# Altium project P_22_CtlBrd.PrjPcb
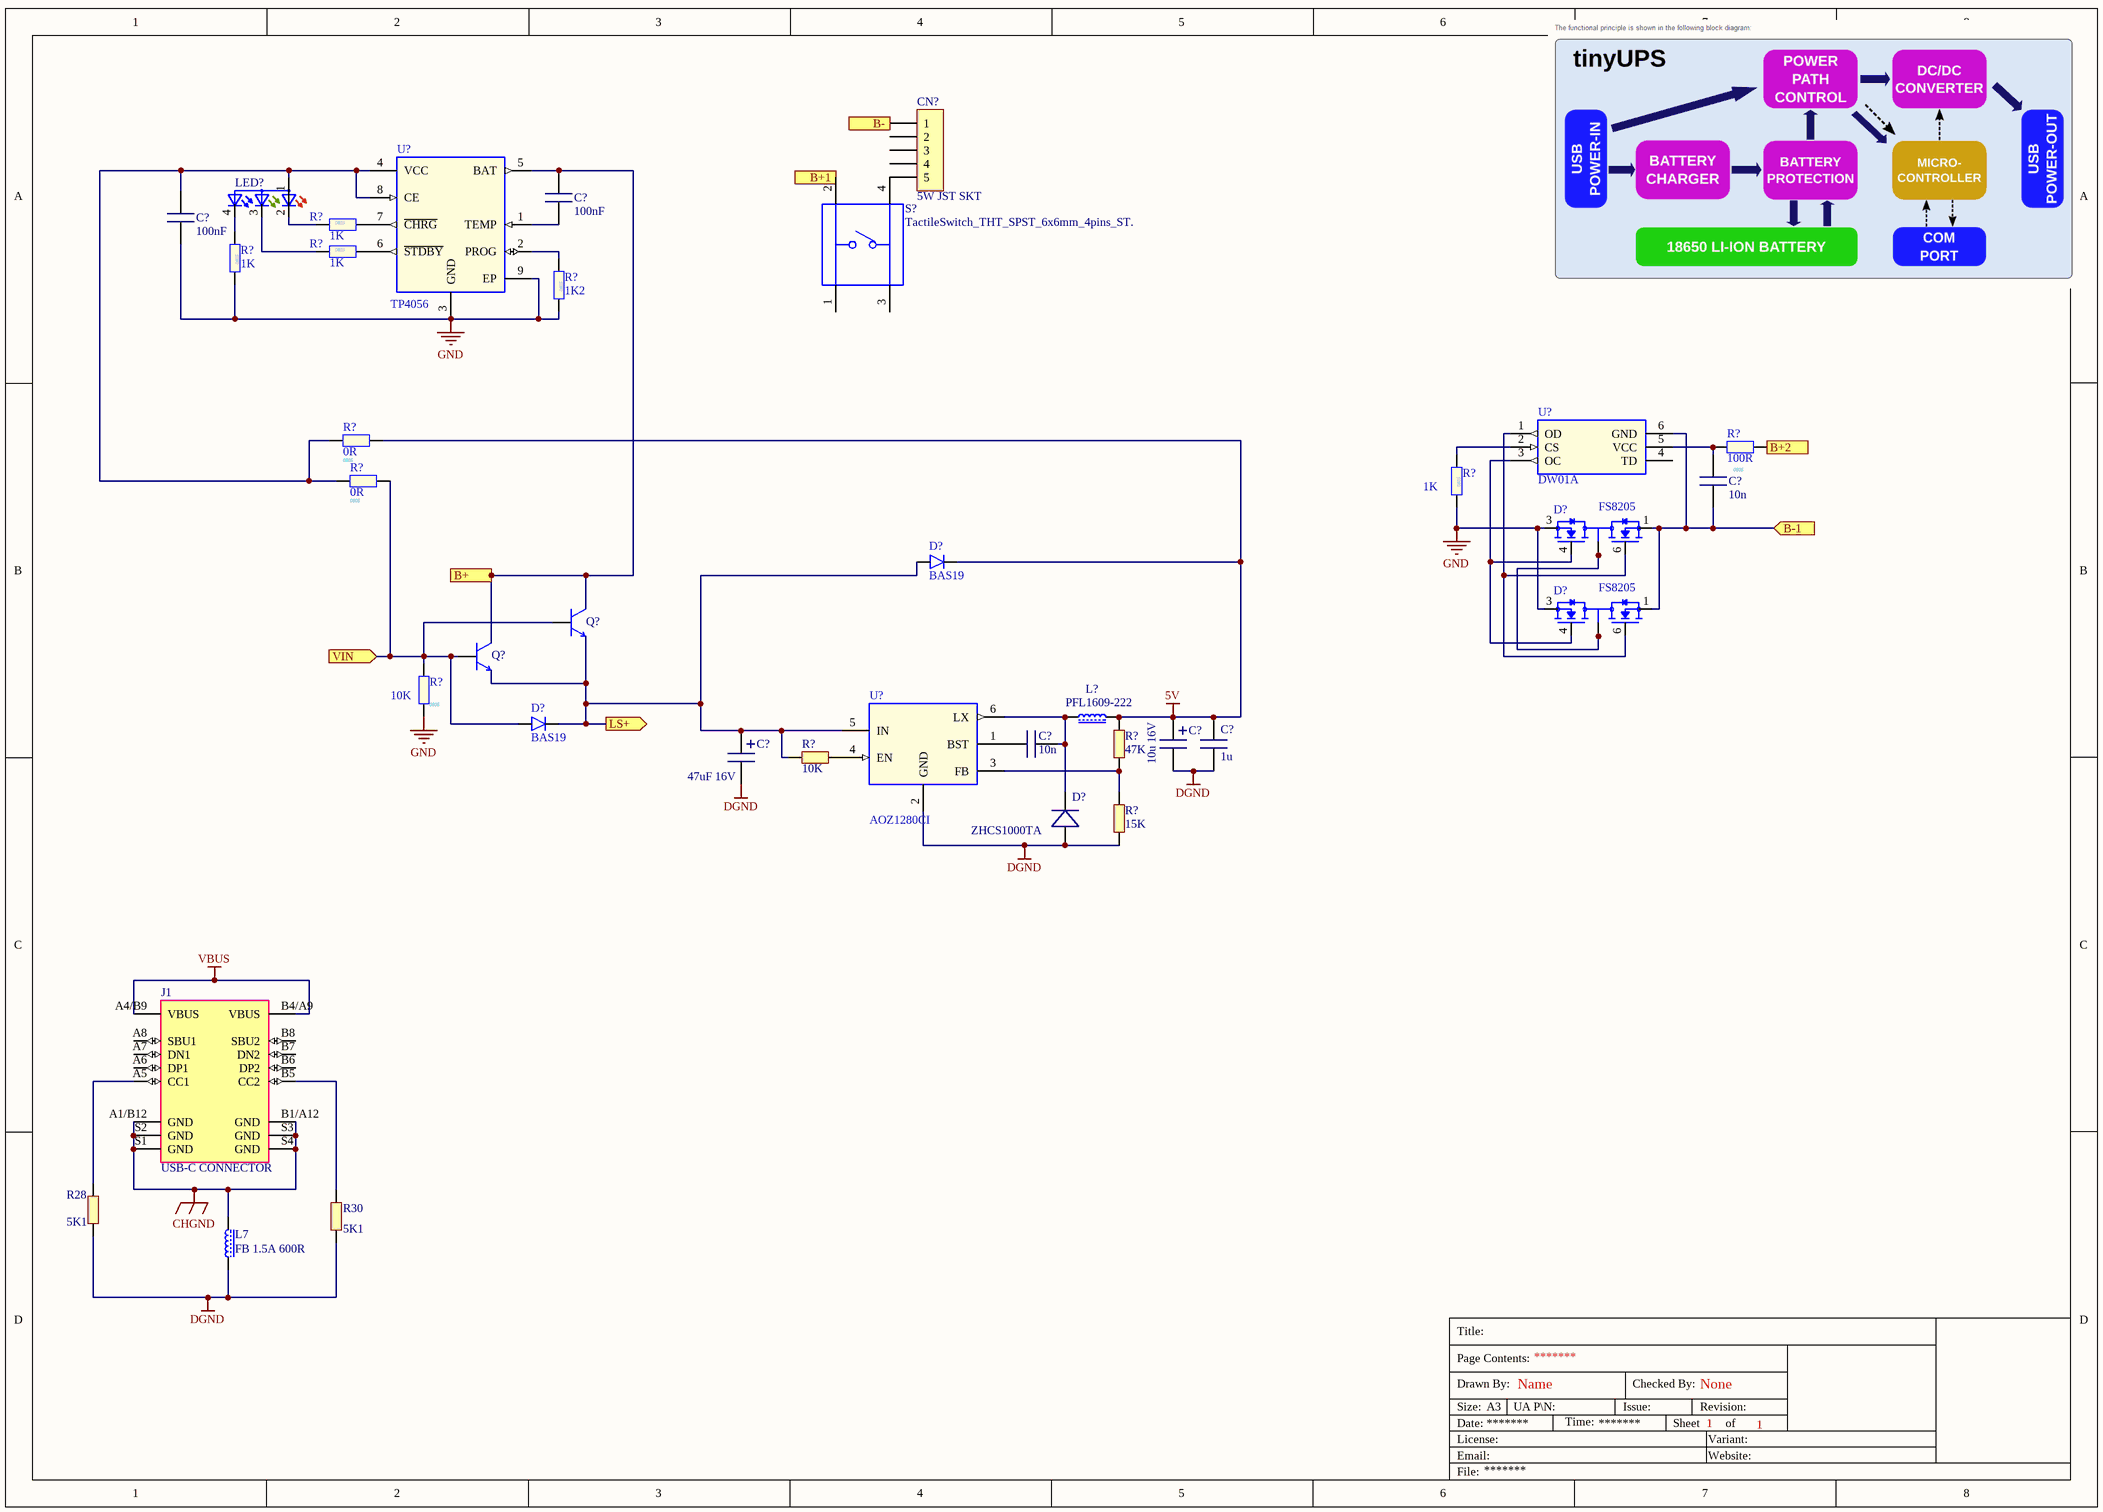
[diagram p0: CtlBoard - Copy.SchDoc]
2 sheets, 74 parts. Net scope: flat (ports and power ports of the same name join across sheets).
Sheets:
  CtlBoard - Copy.SchDoc
  CtlBoard.SchDoc

## Sheet CtlBoard - Copy.SchDoc: Title
size A3; Date: *******; ApprovedBy: *******; CheckedBy: None; Author: *******; CompanyName: *******; DrawnBy: Name; Engineer: *******; Organization: *******; Address1: *******; Address2: *******; Address3: *******; Address4: *******; DocumentNumber: Doc Num; Revision: *******; SheetNumber: 1; SheetTotal: 1; CurrentTime: *******; CurrentDate: *******; Time: *******; DocumentFullPathAndName: *******; DocumentName: *******; ModifiedDate: *******; ImagePath: *******; ProjectName: *******; Application_BuildNumber: *******

### Parts
(Parts that share a designator on the sheet are numbered #1, #2 ... from top to bottom, then left to right.)
C?#1  100nF  [CAP 0402]
C?#2  100nF  [CAP 0402]
C?#3  10n  [CAP 0805]
C?#4  10n  [CAP 0805]
C?#5  10u 16V  [CAP CASE B]
C?#6  1u  [CAP 0805]
C?#7  47uF 16V  [CAP CASE D]
CN?  5W JST SKT  [[0507]THT_Hdr_JST_XH_Fm_5x1_0.08_ST]
D?#1  FS8205  [SOT95P280X145-6N]
D?#2  BAS19  [SOT95P230X110-3N]
D?#3  FS8205  [SOT95P280X145-6N]
D?#4  BAS19  [SOT95P230X110-3N]
D?#5  ZHCS1000TA  [SOT-23]
J1#1  USB-C CONNECTOR  [GCT_USB4110-GF-A_REVB]
L7  FB 1.5A 600R  [RES 1206]
L?  PFL1609-222  [PL1609]
LED?  ASMB-KTF0-0A306  [LED_ASMB-KTF0-0A306]  (value not drawn)
Q?#1  BC846A  [[0301]BC846B_SOT23]  (value not drawn)
Q?#2  BC846A  [[0301]BC846B_SOT23]  (value not drawn)
R28  5K1  [RES 0805]
R30  5K1  [RES 0805]
R?#1  1K  Footprint: 0805  [RES 0805]
R?#2  1K  Footprint: 0805  [RES 0805]
R?#3  1K  Footprint: 0805  [RES 0805]
R?#4  1K2  Footprint: 0805  [RES 0805]
R?#5  0R  Footprint: 0805  [RES 0805]
R?#6  100R  Footprint: 0805  [RES 0805]
R?#7  0R  Footprint: 0805  [RES 0805]
R?#8  1K  Footprint: 0805  [RES 0805]
R?#9  10K  Footprint: 0805  [RES 0805]
R?#10  47K  [RES 0805]
R?#11  10K  [RES 0805]
R?#12  15K  [RES 0805]
S?  TactileSwitch_THT_SPST_6x6mm_4pins_ST.  [TactileSwitch_THT_SPST_6x6mm_4pins_ST]
U?#1  TP4056  [SOP127P600X175-9N]
U?#2  DW01A  [SOT95P280X145-6N]
U?#3  AOZ1280CI  [SOT95P280X145-6N]

### Ports
B+1 (in), B+2 (in), B+ (in), B-1 (in), B- (in), LS+ (out), VIN (in)

### Nets
5V: C?#5.1 C?#6.2 D?#2.3(K) L?.2 R?#5.1 R?#10.2
CHGND: J1#1.A1/B12(GND) J1#1.B1/A12(GND) J1#1.S1(GND) J1#1.S2(GND) J1#1.S3(GND) J1#1.S4(GND) L7.2
DGND: C?#5.2 C?#6.1 C?#7.2 D?#5.1(A) L7.1 R28.1 R30.1 R?#12.1 U?#3.2(GND)
GND: C?#2.1 D?#1.3(S2) D?#3.3(S2) R?#3.1 R?#4.1 R?#8.1 R?#9.1 U?#1.3(GND) U?#1.9(EP)
VBUS: J1#1.A4/B9(VBUS) J1#1.B4/A9(VBUS)
NetC?#1_1: C?#1.1 U?#1.1(TEMP)
NetC?#1_2: C?#1.2 Q?#1.3(C) Q?#2.3(C) U?#1.5(BAT) ; port B+
NetC?#2_2: C?#2.2 LED?.1(A) R?#5.2 R?#7.2 U?#1.4(VCC) U?#1.8(CE)
NetC?#3_1: C?#3.1 D?#1.1(S1) D?#3.1(S1) U?#2.6(GND) ; port B-1
NetC?#3_2: C?#3.2 R?#6.2 U?#2.5(VCC)
NetC?#4_1: C?#4.1 U?#3.1(BST)
NetC?#4_2: C?#4.2 D?#5.3(C) L?.1 U?#3.6(LX)
NetC?#7_1: C?#7.1 D?#2.1(A) D?#4.3(K) Q?#1.2(E) Q?#2.2(E) R?#11.1 U?#3.5(IN) ; port LS+
NetCN?_1: CN?.1 ; port B-
NetCN?_5: CN?.5 S?.4
NetD?#1_2: D?#1.2(D12) D?#1.5(D12) D?#3.2(D12) D?#3.5(D12)
NetD?#1_4: D?#1.4(G2) D?#3.4(G2) U?#2.3(OC)
NetD?#1_6: D?#1.6(G1) D?#3.6(G1) U?#2.1(OD)
NetD?#4_1: D?#4.1(A) Q?#1.1(B) Q?#2.1(B) R?#7.1 R?#9.2 ; port VIN
NetJ1#1_A5: J1#1.A5(CC1) R28.2
NetJ1#1_B5: J1#1.B5(CC2) R30.2
NetLED?_2: LED?.2(CRED) R?#1.1
NetLED?_3: LED?.3(CGREEN) R?#2.1
NetLED?_4: LED?.4(CBLUE) R?#3.2
NetR?#1_2: R?#1.2 U?#1.7(~{CHRG})
NetR?#2_2: R?#2.2 U?#1.6(~{STDBY})
NetR?#4_2: R?#4.2 U?#1.2(PROG)
NetR?#6_1: R?#6.1 ; port B+2
NetR?#8_2: R?#8.2 U?#2.2(CS)
NetR?#10_1: R?#10.1 R?#12.2 U?#3.3(FB)
NetR?#11_2: R?#11.2 U?#3.4(EN)
NetS?_2: S?.2 ; port B+1

Not connected (* = marked no-connect by the designer): CN? 2 3 4; J1#1 A6(DP1) A7(DN1) A8(SBU1) B6(DP2) B7(DN2) B8(SBU2); S? 1 3; U?#2 4(TD)

### Notes on the sheet
- Title:
- Drawn By:
- Page Contents:
- Checked By:
- Size:
- Date:
- File:
- License:
- Email:
- A3
- UA P\N:
- Time:
- Issue:
- Sheet
- Revision:
- Website:
- Variant:
- of

### Library data of the parts
C?#1 C?#2 = CAP0402_100nF: Standard 0402 Capacitor, 5%, MLCC; UA P/N: 16-00; MN: YAGEO; MP: CC0402KRX7R7BB104; Value: 100nF; Footprint: 0402; Type: MLCC; Farnell: *; Mouser: *; DigiKey: *; LCSC: C60474; My_P/N: *
C?#3 C?#4 = 10n: Standard 0805 Capacitor; Type: X7R; Voltage: 50V; Value: 10n; Footprint: 0805
C?#5 = 10u 16V: Standard Case B Electrolytic Capacitor; Type: Al; UA P/N: 16-0026; Voltage: 16; Value: 10u 16V
C?#6 = 1u: Standard 0805 Capacitor; Type: X7R; UA P/N: 16-0010; Voltage: 50V; Value: 1u; Footprint: 0805
C?#7 = 47uF 16V: Standard Case D Electrolytic Capacitor; Type: AL; UA P/N: 16-0046; Value: 47uF 16V
CN? = [0507]THT_Hdr_JST_XH_Fm_5x1_0.08_ST: JST PH 5
D?#1 D?#3 = FS8205_1: Dual N-Channel Enhancement Mode Power MOSFET; MP: FS8205A; UA P/N: 15-0xxx; Farnell: *; Mouser: *; RS: *; DigiKey: *; Arrow: *; Profusion: *; My_P/N: *; HelpURL: http://forsemi.com; Package: SOT95P280X145-6N; Value: FS8205; ComponentLink1Description: Web MF; ComponentLink1URL: http://forsemi.com; ComponentLink2Description: Datasheet web; ComponentLink2URL: https://pdf1.alldatasheet.com/datasheet-pdf/view/1132762/FORTUNE/FS8205A.html; ComponentLink3Description: Datasheet local; ComponentLink3URL: /D/
D?#2 D?#4 = BAS19: Rectifier Diode Switching 120V 0.2A 50ns Automotive 3-Pin SOT-23 T/R; UA P/N: 15-0xxx; MP: BAS19; Farnell: *; Mouser: *; RS: *; DigiKey: *; Arrow: *; Profusion: *; My_P/N: *; HelpURL: https://www.nexperia.com/products/diodes/automotive-diodes/automotive-switching-diodes/automotive-general-purpose-switching-diodes/BAS19.html; Package: SOT95P230X110-3N; Value: BAS19; ComponentLink1Description: Web MF; ComponentLink1URL: https://www.nexperia.com; ComponentLink2Description: Datasheet web; ComponentLink2URL: https://www.nexperia.com/products/diodes/automotive-diodes/automotive-switching-diodes/automotive-general-purpose-switching-diodes/BAS19.html; ComponentLink3Description: Datasheet local; ComponentLink3URL: /D/
D?#5 = ZHCS1000TA: SOT23 Diode; Type: 40V 1A Schottky Diode; UA P/N: 15-0119; Value: ZHCS1000TA
J1#1 = USB-C CONNECTOR: USB-C (USB TYPE-C) USB 2.0 Type C. Receptacle Connector 24 (16+8 Dummy) Position Surface Mount, Right Angle; Through Hole; MF: GCT; MP: USB4110-GF-A; UA P/N: 112-0099; Value: USB-C CONNECTOR; Price: None; Package: None; SnapEDA_Link: https://www.snapeda.com/parts/USB4110-GF-A/Global%20Connector%20Technology/view-part/4001167/?ref=snap; Availability: Warning; Purchase-URL: https://pricing.snapeda.com/search/part/USB4110-GF-A/?ref=eda; Check_prices: https://www.snapeda.com/parts/USB4110-GF-A/Global%20Connector%20Technology/view-part/4001167/?ref=eda; Mouser: 640-USB4110-GF-A; LSCS: *; Type: SMD; Mounting: THT
L7 = FB 1.5A 600R: 1206 inductor; Type: MI1206K601R-10; UA P/N: 113-0008; Value: FB 1.5A 600R; Mounting: SMT
L? = PFL1609-222: COILCRAFT PLF1609; Type: COILCRAFT 2.2uH Ind; UA P/N: 113-0031; Value: PFL1609-222
LED? = ASMB-KTF0-0A306: Red, Green, Blue _RGB_ 620nm Red, 524nm Green, 471nm Blue LED Indication - Discrete 2V Red, 2.95V Green, 2.85V Blue 4-PLCC; MF: Broadcom Limited; Availability: Unavailable; Price: None; Package: PLCC-4 Broadcom; MP: ASMB-KTF0-0A306; Value: *; SnapEDA_Link: https://www.snapeda.com/parts/ASMB-KTF0-0A306/Broadcom%20Limited/view-part/2703546/?ref=snap
Q?#1 Q?#2 = NPN SOT-23: NPN SOT-23 transistor [0301]BC846B_SOT23; MN: Nexperia; MP: BC846A,215; Value: BC846A; LCSC: C90281; My P/N: *
R28 R30 = 5K1: Standard 0805 Resistor; UA P/N: 13-0111; Value: 5K1; Footprint: 0805; Type: THICK FILM; Mounting: SMT
R?#1-R?#9 = RES0805_NF: Standard 0805 Resistor, 5%, Thick Film; Value: NF; MF: YAGEO; MP: RC0402JR-070RL; UA P/N: 13-0xxx; LCSC: C60485; Farnell: *; Mouser: *; RS: *; DigiKey: *; Arrow: *; Profusion: *; My_P/N: *; Parameter 14: *; Package: RES 0805
R?#10 = 47K: Standard 0805 Resistor; UA P/N: 13-0058; Value: 47K; Footprint: 0805; Type: THICK FILM
R?#11 = 10K: Standard 0805 Resistor; UA P/N: 13-0007; Value: 10K; Footprint: 0805; Type: THICK FILM
R?#12 = 15K: Standard 0805 Resistor; UA P/N: 13-0017; Value: 15K; Footprint: 0805; Type: THICK FILM
S? = TactileSwitch_THT_SPST_6x6mm_4pins_ST.: S02-66-95-BK-160-LCR-D; MF: {'manufacturer': u'CUI'}; MP: TS02-66-95-BK-160-LCR-D; Price: None; Value: *; Package: None; Availability: Unavailable
U?#1 = TP4056_1: Complete single cell Li-Ion battery with a constant current / constant voltage linear charger; UA P/N: 15-0xxx; Value: TP4056; MF: *; MP: *; LCSC: *; Farnell: *; Mouser: *; RS: *; DigiKey: *; Arrow: *; Profusion: *; My_P/N: *; Footprint: *; Package: SOP127P600X175-9N
U?#2 = DW01A_1: One Cell Lithium-ion/Polymer Battery Protection IC; MP: FS8205A; UA P/N: 15-0xxx; Farnell: *; Mouser: *; RS: *; DigiKey: *; Arrow: *; Profusion: *; My_P/N: *; HelpURL: https://cxem.net/master/files/97_DW01A-DS-11_EN.pdf; Package: SOT95P280X145-6N; Value: DW01A; ComponentLink1Description: Web MF; ComponentLink1URL: https://hmsemi.com; ComponentLink2Description: Datasheet web; ComponentLink2URL: https://pdf1.alldatasheet.com/datasheet-pdf/view/1150541/HMSEMI/DW01A.html; ComponentLink3Description: Datasheet local; ComponentLink3URL: /D/
U?#3 = AOZ1280CI: Buck Switching Regulator IC Positive Adjustable 0.8V 1 Output 1.2A SOT-23-; MP: FS8205A; UA P/N: 15-0xxx; Farnell: *; Mouser: *; RS: *; DigiKey: *; Arrow: *; Profusion: *; My_P/N: *; HelpURL: https://aosmd.com/products/power-ics/ezbuck-dc-dc-buck-regulators/AOZ1280CI; Package: SOT95P280X145-6N; Value: AOZ1280CI; ComponentLink1Description: Web MF; ComponentLink1URL: https://aosmd.com; ComponentLink2Description: Datasheet web; ComponentLink2URL: https://pdf1.alldatasheet.com/datasheet-pdf/view/483045/AOSMD/AOZ1280CI.html; ComponentLink3Description: Datasheet local; ComponentLink3URL: /D/

## Sheet CtlBoard.SchDoc: Title
size A3; Date: *******; ApprovedBy: *******; CheckedBy: None; Author: *******; CompanyName: *******; DrawnBy: Name; Engineer: *******; Organization: *******; Address1: *******; Address2: *******; Address3: *******; Address4: *******; DocumentNumber: Doc Num; Revision: *******; SheetNumber: 1; SheetTotal: 1; CurrentTime: *******; CurrentDate: *******; Time: *******; DocumentFullPathAndName: *******; DocumentName: *******; ModifiedDate: *******; ImagePath: *******; ProjectName: *******; Application_BuildNumber: *******
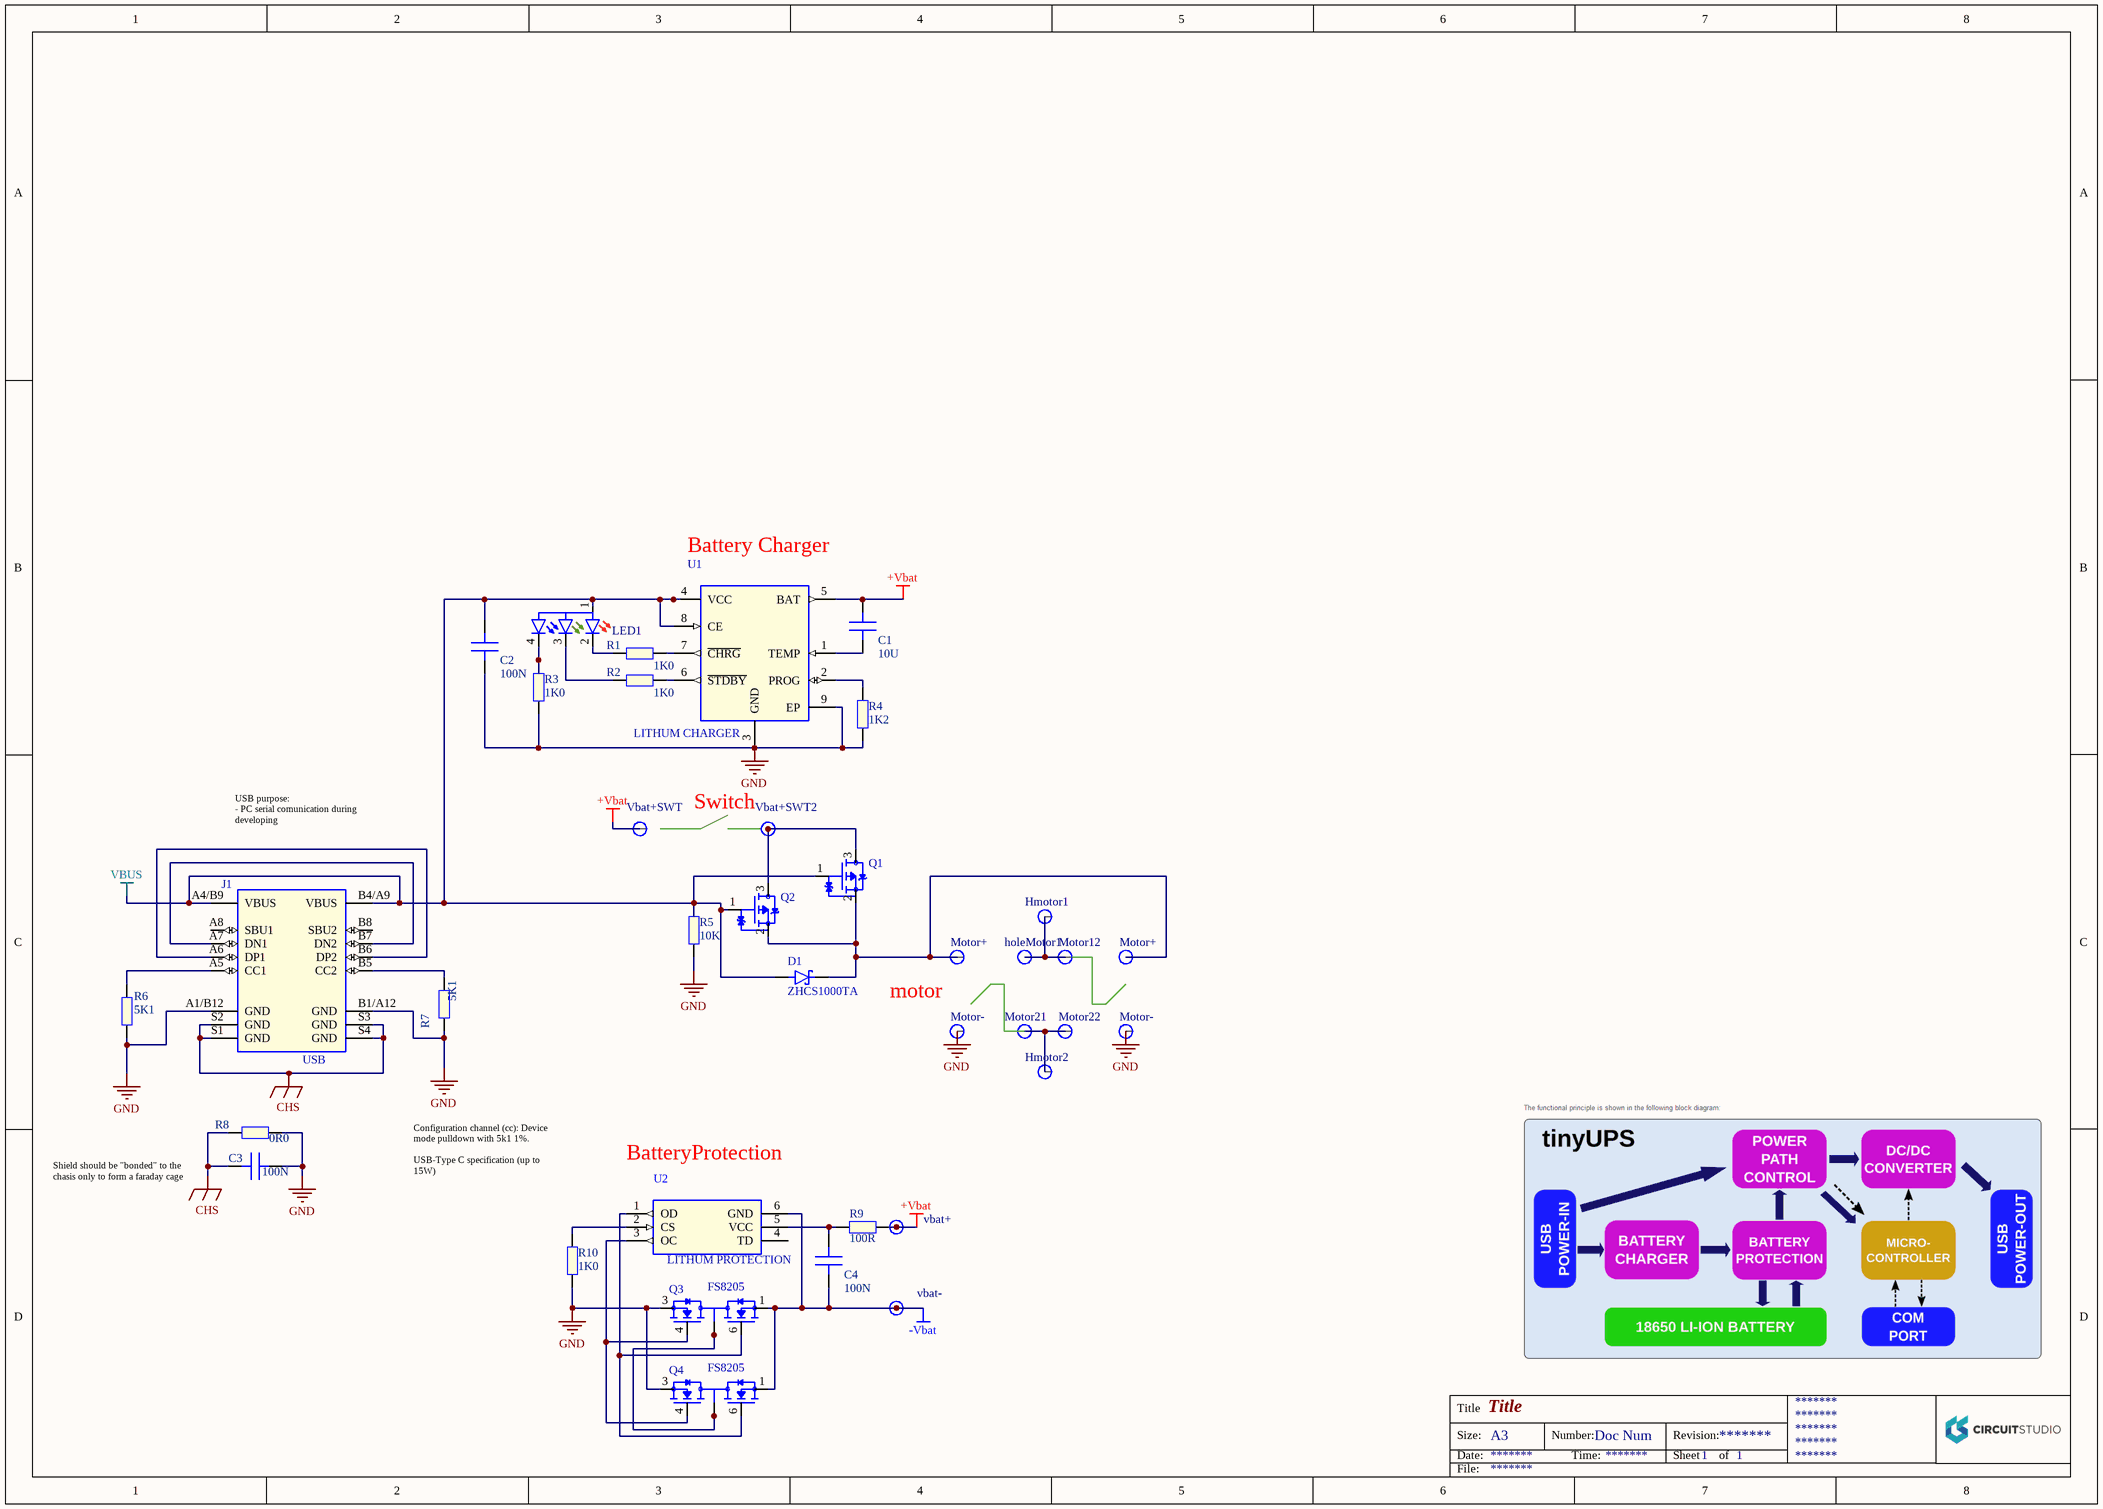
[diagram p1: CtlBoard.SchDoc]

### Parts
(Parts that share a designator on the sheet are numbered #1, #2 ... from top to bottom, then left to right.)
C1  10U  [CAPC2012X60N]
C2  100N  [CAPC2012X60N]
C3  100N  [CAPC2012X60N]
C4  100N  [CAPC2012X60N]
D1  ZHCS1000TA  [SOT95P230X110-3N]
Hmotor1  TESTPINT  [P200X100H90L100H50]  (value not drawn)
Hmotor2  TESTPINT  [P200X100H90L100H50]  (value not drawn)
holeMotor1  TESTPINT  [P200X100H90L100H50]  (value not drawn)
J1#2  USB  [GCT_USB4110-GF-A_REVB]
LED1  LED RGB  [LEDSC220X200X190-4]  (value not drawn)
Motor12  TESTPINT  [P200X100H90L100H50]  (value not drawn)
Motor21  TESTPINT  [P200X100H90L100H50]  (value not drawn)
Motor22  TESTPINT  [P200X100H90L100H50]  (value not drawn)
Motor+#1  TESTPINT  [P200X100H90L100H50]  (value not drawn)
Motor+#2  TESTPINT  [P200X100H90L100H50]  (value not drawn)
Motor-#1  TESTPINT  [P200X100H90L100H50]  (value not drawn)
Motor-#2  TESTPINT  [P200X100H90L100H50]  (value not drawn)
Q1  (no value)  [SOT91P240X110-3N]
Q2  (no value)  [SOT91P240X110-3N]
Q3  FS8205  [SOT95P280X145-6N]
Q4  FS8205  [SOT95P280X145-6N]
R1  1K0  [RESC2012X60N]
R2  1K0  [RESC2012X60N]
R3  1K0  [RESC2012X60N]
R4  1K2  [RESC2012X60N]
R5  10K  [RESC2012X60N]
R6  5K1  [RESC2012X60N]
R7  5K1  [RESC2012X60N]
R8  0R0  [RESC2012X60N]
R9  100R  [RESC2012X60N]
R10  1K0  [RESC2012X60N]
U1  LITHUM CHARGER  [SOP127P600X175-9N]
U2  LITHUM PROTECTION  [SOT95P280X145-6N]
vbat+  TESTPINT  [P200X100H90L100H50]  (value not drawn)
Vbat+SWT  TESTPINT  [P200X100H90L100H50]  (value not drawn)
Vbat+SWT2  TESTPINT  [P200X100H90L100H50]  (value not drawn)
vbat-  TESTPINT  [P200X100H90L100H50]  (value not drawn)

### Nets
+Vbat: C1.2 R9.1 U1.5(BAT) vbat+.1 Vbat+SWT.1
-Vbat: C4.1 Q3.1(S1) Q4.1(S1) U2.6(GND) vbat-.1
CHS: C3.1 J1#2.S1(GND) J1#2.S2(GND) J1#2.S3(GND) J1#2.S4(GND) R8.2
GND: C2.1 C3.2 J1#2.A1/B12(GND) J1#2.B1/A12(GND) Motor-#1.1 Motor-#2.1 Q3.3(S2) Q4.3(S2) R3.1 R4.1 R5.1 R6.1 R7.1 R8.1 R10.1 U1.3(GND) U1.9(EP)
VBUS: C2.2 D1.3(A) J1#2.A4/B9(VBUS) J1#2.B4/A9(VBUS) LED1.1(A) Q1.1(G) Q2.1(G) R5.2 U1.4(VCC) U1.8(CE)
NetC1_1: C1.1 U1.1(TEMP)
NetC4_2: C4.2 R9.2 U2.5(VCC)
NetD1_1: D1.1(K) Motor+#1.1 Motor+#2.1 Q1.2(S) Q2.2(S)
NetHmotor1_1: Hmotor1.1 holeMotor1.1 Motor12.1
NetHmotor2_1: Hmotor2.1 Motor21.1 Motor22.1
NetJ1#2_A5: J1#2.A5(CC1) R6.2
NetJ1#2_A6: J1#2.A6(DP1) J1#2.B6(DP2)
NetJ1#2_A7: J1#2.A7(DN1) J1#2.B7(DN2)
NetJ1#2_B5: J1#2.B5(CC2) R7.2
NetLED1_2: LED1.2(CRED) R1.1
NetLED1_3: LED1.3(CGREEN) R2.1
NetLED1_4: LED1.4(CBLUE) R3.2
NetQ1_3: Q1.3(D) Q2.3(D) Vbat+SWT2.1
NetQ3_2: Q3.2(D12) Q3.5(D12) Q4.2(D12) Q4.5(D12)
NetQ3_4: Q3.4(G2) Q4.4(G2) U2.3(OC)
NetQ3_6: Q3.6(G1) Q4.6(G1) U2.1(OD)
NetR1_2: R1.2 U1.7(~{CHRG})
NetR2_2: R2.2 U1.6(~{STDBY})
NetR4_2: R4.2 U1.2(PROG)
NetR10_2: R10.2 U2.2(CS)

Not connected (* = marked no-connect by the designer): J1#2 A8(SBU1) B8(SBU2); U2 4(TD)

### Notes on the sheet
- Battery Charger
- USB purpose:
  - PC serial comunication during developing
- (near Vbat+SWT2) Switch
- motor
- Shield should be "bonded" to the chasis only to form a faraday cage
- Configuration channel (cc): Device mode pulldown with 5k1 1%.
  USB-Type C specification (up to 15W)
- BatteryProtection
- Title
- Size:
- Date:
- A3
- Number:
- Time:
- Revision:
- Sheet
- of
- File:

### Library data of the parts
C1 = 139: 10U 0805  X6S 35V SMD Ceramic capacitor; UA P/N: 16-0004; Unique ID: 139; LibraryVersion: v1; Value: 10U; Farnell: 3581774; My_PN: *; Mounting: SMT; Cost: 0.172; Category: [0000] Passive components; Subcategory: [0002] Capacitor
C2-C4 = 118: 100N 0805 X7R 5% 50V SMD Ceramic capacitor; UA P/N: 16-0001; Unique ID: 118; LibraryVersion: v1; Value: 100N; Farnell: 2408561; My_PN: *; Mounting: SMT; Cost: 0.0195; Category: [0000] Passive components; Subcategory: [0002] Capacitor
D1 = 219: ZHCS1000TA Schottky Rectifier, 40V 1A 425 mV; UA P/N: 15-0119; Unique ID: 219; LibraryVersion: v1; Farnell: 9526773; Value: ZHCS1000TA; ComponentLink1Description: Web MF; ComponentLink1URL: https://www.diodes.com; ComponentLink2Description: Datasheet web; ComponentLink2URL: https://pdf1.alldatasheet.com/datasheet-pdf/view/515456/DIODES/ZHCS1000TA.html; ComponentLink3Description: Datasheet local; ComponentLink3URL: /D/; Cost: 0.157; Category: [0300] Discrete Semiconductors; Subcategory: [0308] Schottky Diodes; Mounting: SMT
Hmotor1 Hmotor2 holeMotor1 Motor12 Motor21 Motor22 Motor+#1 Motor+#2 Motor-#1 Motor-#2 vbat+ Vbat+SWT Vbat+SWT2 vbat- = 509: Unique ID: 509; Value: TESTPINT; Farnell: P50-H-120-G; Category: [0500] Connectors; Subcategory: [0510] Test pins
J1#2 = 399: USB C CONNECTOR SMD; UA P/N: 112-0099; Unique ID: 399; LibraryVersion: V1; Value: USB; Farnell: 3588206; ComponentLink1Description: Web MF; ComponentLink1URL: https://gct.co; ComponentLink2Description: Datasheet web; ComponentLink2URL: https://pdf1.alldatasheet.com/datasheet-pdf/view/1355856/ETC/USB4110-GF-A.html; ComponentLink3Description: Datasheet local; ComponentLink3URL: /D/; Cost: 0.662; Category: [0500] Connectors; Subcategory: [0502] USB connectors; Mounting: SMD
LED1 = 557: ASMB-KTF0-0A306; Unique ID: 557; LibraryVersion: v1; Availability: Unavailable; Price: None; Value: LED RGB; SnapEDA_Link: https://www.snapeda.com/parts/ASMB-KTF0-0A306/Broadcom%20Limited/view-part/2703546/?ref=snap; Cost: 0; Category: [0400] Optoelectronics; Subcategory: [0401] LEDs; Mounting: SMT
Q1 Q2 = 527: MOSFET; Unique ID: 527; LibraryVersion: V1; ComponentLink1Description: Web MF; ComponentLink1URL: https://www.diodes.com; ComponentLink2Description: Datasheet web; ComponentLink2URL: https://html.alldatasheet.com/html-pdf/833068/DIODES/DMP1045U/217/1/DMP1045U.html; ComponentLink3Description: Datasheet local; ComponentLink3URL: /D/; Cost: 0; Category: [0300] Discrete Semiconductors; Subcategory: [0303] MOSFETs; Mounting: SMT
Q3 Q4 = FS8205_1: as D?#1 on sheet CtlBoard - Copy; Farnell: *; Mouser: *; RS: *; DigiKey: *; Arrow: *; Profusion: *; My_P/N: *; HelpURL: http://forsemi.com; Package: SOT95P280X145-6N; Value: FS8205; ComponentLink1Description: Web MF; ComponentLink1URL: http://forsemi.com; ComponentLink2Description: Datasheet web; ComponentLink2URL: https://pdf1.alldatasheet.com/datasheet-pdf/view/1132762/FORTUNE/FS8205A.html; ComponentLink3Description: Datasheet local; ComponentLink3URL: /D/; Mounting: SMT
R1-R3 R10 = 21: 1K0 0805 Thick Film 1% Resistor; UA P/N: 13-0022; Unique ID: 21; LibraryVersion: v1; Value: 1K0; Farnell: 2446904; Mounting: SMT; My_PN: *; Cost: 0.00214; Category: [0000] Passive components; Subcategory: [0001] Resistor
R4 = 23: 1K2 0805 Thick Film 1% Resistor; UA P/N: 13-0024; Unique ID: 23; LibraryVersion: v1; Value: 1K2; Farnell: 2446906; Mounting: SMT; My_PN: *; Cost: 0.00352; Category: [0000] Passive components; Subcategory: [0001] Resistor
R5 = 6: 10K 0805Thick Film 1% Resistor; UA P/N: 13-0007; Unique ID: 6; LibraryVersion: v1; Value: 10K; Farnell: 2446870; Mounting: SMT; My_PN: *; Cost: 0.0014; Category: [0000] Passive components; Subcategory: [0001] Resistor
R6 R7 = 109: 5K1  0805 Thick Film 1% Resistor; UA P/N: 13-0111; Unique ID: 109; LibraryVersion: v1; Value: 5K1; Farnell: 2447009; My_PN: *; Mounting: SMT; Cost: 0.00176; Category: [0000] Passive components; Subcategory: [0001] Resistor
R8 = 0: 0R0 0805Thick Film 1% Resistor; UA P/N: 13-0001; Unique ID: 0; LibraryVersion: v1; Value: 0R0; Farnell: 2692652; My_PN: *; Mounting: SMT; Cost: 0.0049; Category: [0000] Passive components; Subcategory: [0001] Resistor
R9 = 3: 100R 0805Thick Film 1% resistor; UA P/N: 13-0004; Unique ID: 3; LibraryVersion: v1; Value: 100R; Farnell: 2446869; Mounting: SMT; My_PN: *; Cost: 0.00218; Category: [0000] Passive components; Subcategory: [0001] Resistor
U1 = 558: Unique ID: 558; LibraryVersion: v1; Value: LITHUM CHARGER; Footprint: *; Cost: 0; Category: [0100] Integrated circuits; Subcategory: [0117] Battery Management; Mounting: SMT
U2 = 559: Unique ID: 559; LibraryVersion: v1; Value: LITHUM PROTECTION; ComponentLink1Description: Web MF; ComponentLink1URL: https://hmsemi.com; ComponentLink2Description: Datasheet web; ComponentLink2URL: https://pdf1.alldatasheet.com/datasheet-pdf/view/1150541/HMSEMI/DW01A.html; ComponentLink3Description: Datasheet local; ComponentLink3URL: /D/; Cost: 0; Category: [0100] Integrated circuits; Subcategory: [0117] Battery Management; Mounting: SMT

## Nets that join several sheets
GND: CtlBoard - Copy (9 pins), CtlBoard (17 pins)
VBUS: CtlBoard - Copy (J1#1.A4/B9 J1#1.B4/A9), CtlBoard (10 pins)